# EAGLE design radio1 (EAGLE 7.1.0)
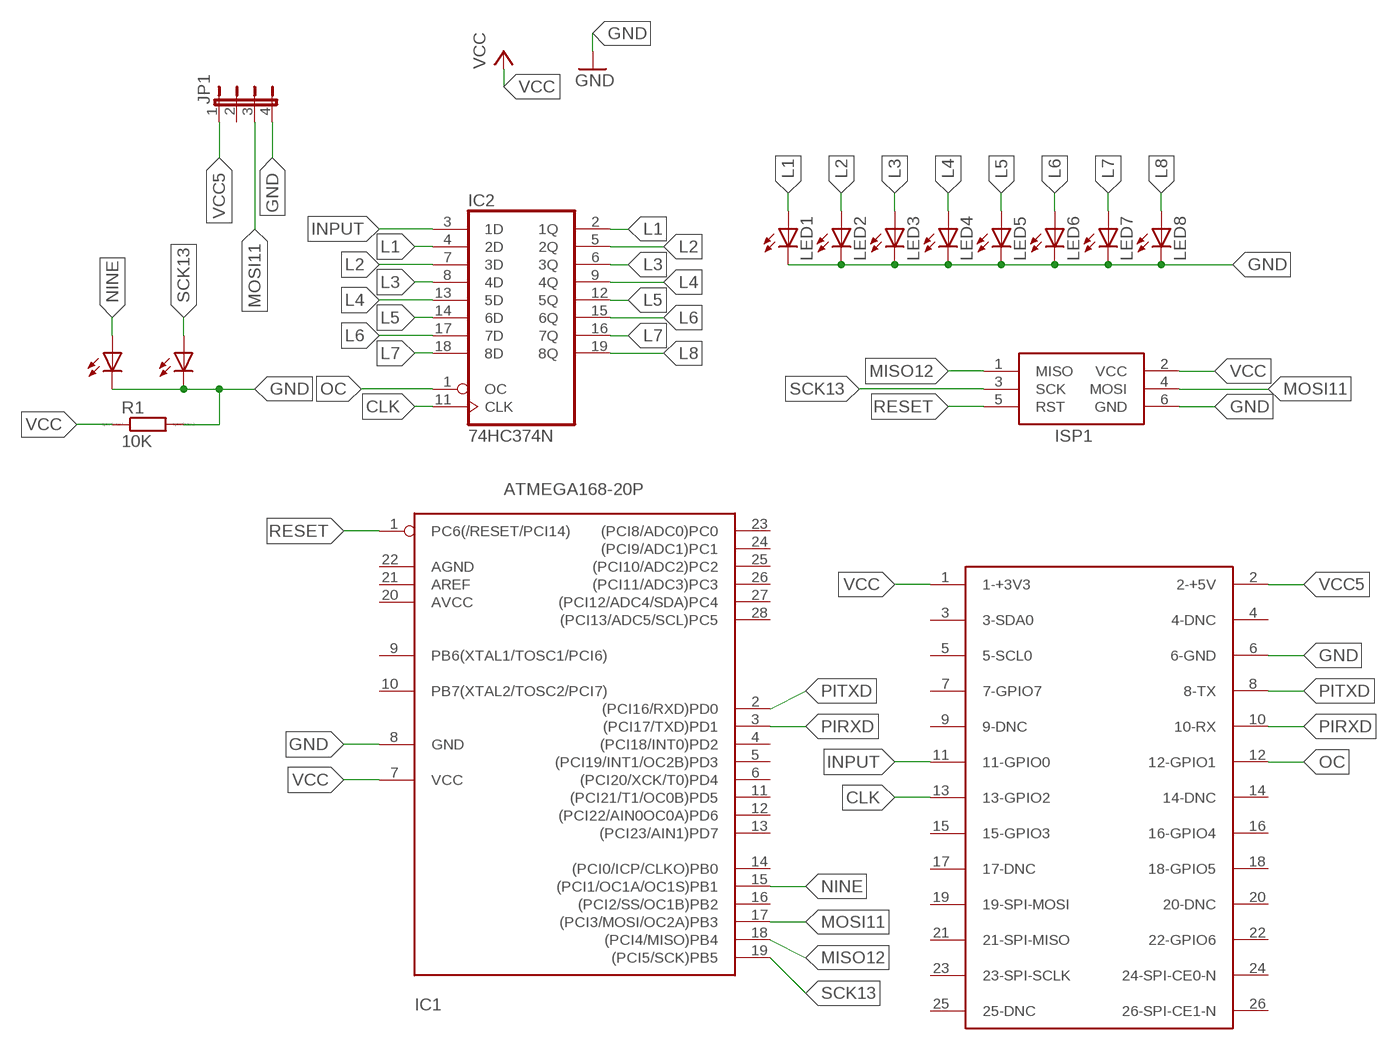
[diagram p0: schematic, sheet 1]

## Parts
IC1  ATMEGA168-20P  [DIL28-3]
IC2  74HC374N  [DIL20]
ISP1  AVRISP-6  [AVRISP]
JP1  JP4E  [JP4]
LED1  LED3MM  [LED3MM]
LED2  LED3MM  [LED3MM]
LED3  LED3MM  [LED3MM]
LED4  LED3MM  [LED3MM]
LED5  LED3MM  [LED3MM]
LED6  LED3MM  [LED3MM]
LED7  LED3MM  [LED3MM]
LED8  LED3MM  [LED3MM]
LED9  LED3MM  [LED3MM]
LED10  LED3MM  [LED3MM]
R1  10K  R-EU_0204_7  [0204/7]
U$1  RASPBERRY-PI  [RASPBERRY-PI]

## Nets
CLK: IC2.11(CLK) U$1.13(13-GPIO2)
GND: IC1.8(GND) ISP1.6(GND) JP1.4 LED1.K(C) LED2.K(C) LED3.K(C) LED4.K(C) LED5.K(C) LED6.K(C) LED7.K(C) LED8.K(C) LED9.K(C) LED10.K(C) R1.2 U$1.6(6-GND)
INPUT: IC2.3(1D) U$1.11(11-GPIO0)
L1: IC2.2(1Q) IC2.4(2D) LED1.A
L2: IC2.5(2Q) IC2.7(3D) LED2.A
L3: IC2.6(3Q) IC2.8(4D) LED3.A
L4: IC2.9(4Q) IC2.13(5D) LED4.A
L5: IC2.12(5Q) IC2.14(6D) LED5.A
L6: IC2.15(6Q) IC2.17(7D) LED6.A
L7: IC2.16(7Q) IC2.18(8D) LED7.A
L8: IC2.19(8Q) LED8.A
MISO12: IC1.18((PCI4/MISO)PB4) ISP1.1(MISO)
MOSI11: IC1.17((PCI3/MOSI/OC2A)PB3) ISP1.4(MOSI) JP1.3
NINE: IC1.15((PCI1/OC1A/OC1S)PB1) LED9.A
OC: IC2.1(OC) U$1.12(12-GPIO1)
PIRXD: IC1.3((PCI17/TXD)PD1) U$1.10(10-RX)
PITXD: IC1.2((PCI16/RXD)PD0) U$1.8(8-TX)
RESET: IC1.1(PC6(/RESET/PCI14)) ISP1.5(RST)
SCK13: IC1.19((PCI5/SCK)PB5) ISP1.3(SCK) LED10.A
VCC: IC1.7(VCC) ISP1.2(VCC) R1.1 U$1.1(1-+3V3)
VCC5: JP1.1 U$1.2(2-+5V)
Unconnected: IC1.4((PCI18/INT0)PD2) IC1.5((PCI19/INT1/OC2B)PD3) IC1.6((PCI20/XCK/T0)PD4) IC1.9(PB6(XTAL1/TOSC1/PCI6)) IC1.10(PB7(XTAL2/TOSC2/PCI7)) IC1.11((PCI21/T1/OC0B)PD5) IC1.12((PCI22/AIN0OC0A)PD6) IC1.13((PCI23/AIN1)PD7) IC1.14((PCI0/ICP/CLKO)PB0) IC1.16((PCI2/SS/OC1B)PB2) IC1.20(AVCC) IC1.21(AREF) IC1.22(AGND) IC1.23((PCI8/ADC0)PC0) IC1.24((PCI9/ADC1)PC1) IC1.25((PCI10/ADC2)PC2) IC1.26((PCI11/ADC3)PC3) IC1.27((PCI12/ADC4/SDA)PC4) IC1.28((PCI13/ADC5/SCL)PC5) JP1.2 U$1.3(3-SDA0) U$1.4(4-DNC) U$1.5(5-SCL0) U$1.7(7-GPIO7) U$1.9(9-DNC) U$1.14(14-DNC) U$1.15(15-GPIO3) U$1.16(16-GPIO4) U$1.17(17-DNC) U$1.18(18-GPIO5) U$1.19(19-SPI-MOSI) U$1.20(20-DNC) U$1.21(21-SPI-MISO) U$1.22(22-GPIO6) U$1.23(23-SPI-SCLK) U$1.24(24-SPI-CE0-N) U$1.25(25-DNC) U$1.26(26-SPI-CE1-N)

## Power pins joined to a net without a drawn wire
GND: IC2.10(GND)
VCC: IC2.20(VCC)

## Library data of the parts
IC1 = adafruit:ATMEGA168*P: MICROCONTROLLER 16 kBytes FLASH 1 kBytes SRAM 512 Bytes EEPROM USART 8-channel 10 bit ADC
IC2 = 74xx-eu:74*374: Octal D type transparent LATCH, edge triggered
ISP1 = adafruit:AVRISP: AVR ISP HEADER Standard 6 pin header for AVR programming
JP1 = jumper:JP4E: JUMPER
LED1-LED10 = adafruit:LED: LED OSRAM: - CHIPLED LG R971, LG N971, LY N971, LG Q971, LY Q971, LO R971, LY R971 LH N974, LH R974 LS Q976, LO Q976, LY Q976 LO Q996 - Hyper CHIPLED LW Q18S LB Q993, LB Q99A, LB R99A - SideLED LS A670, LO A670, LY A670, LG A670, LP A670 LB A673, LV A673, LT A673, LW A673 LH A674 LY A675 LS A676, LA A676, LO A676, LY A676, LW A676 LS A679, LY A679, LG A679 - Hyper Micro SIDELED® LS Y876, LA Y876, LO Y876, LY Y876 LT Y87S - SmartLED LW L88C, LW L88S LB L89C, LB L89S, LG L890 LS L89K, LO L89K, LY L89K LS L896, LA L896, LO L896, LY L896 - TOPLED LS T670, LO T670, LY T670, LG T670, LP T670 LSG T670, LSP T670, LSY T670, LOP T670, LYG T670 LG T671, LOG T671, LSG T671 LB T673, LV T673, LT T673, LW T673 LH T674 LS T676, LA T676, LO T676, LY T676, LB T676, LH T676, LSB T676, LW T676 LB T67C, LV T67C, LT T67C, LS T67K, LO T67K, LY T67K, LW E67C LS E67B, LA E67B, LO E67B, LY E67B, LB E67C, LV E67C, LT E67C LW T67C LS T679, LY T679, LG T679 LS T770, LO T770, LY T770, LG T770, LP T770 LB T773, LV T773, LT T773, LW T773 LH T774 LS E675, LA E675, LY E675, LS T675 LS T776, LA T776, LO T776, LY T776, LB T776 LHGB T686 LT T68C, LB T68C - Hyper Mini TOPLED® LB M676 - Mini TOPLED Santana® LG M470 LS M47K, LO M47K, LY M47K Source: http://www.osram.convergy.de/
R1 = resistor:R-EU_: RESISTOR, European symbol; SPICEPREFIX: R
U$1 = RaspberryPi:RASPBERRY-PI: Raspberry Pi Board <http://www.raspberrypi.org/> Jacques Lagnel V1.0 (beta) 2012 Board dimension: Forum 3D model <http://www.raspberrypi.org/forum/general-discussion/mechanical-profile-3d-models?value=3d%20model&type=1&include=1&search=1&ret=all> The GPIO Connector (P1): http://elinux.org/RPi_Low-level_peripherals

## Board
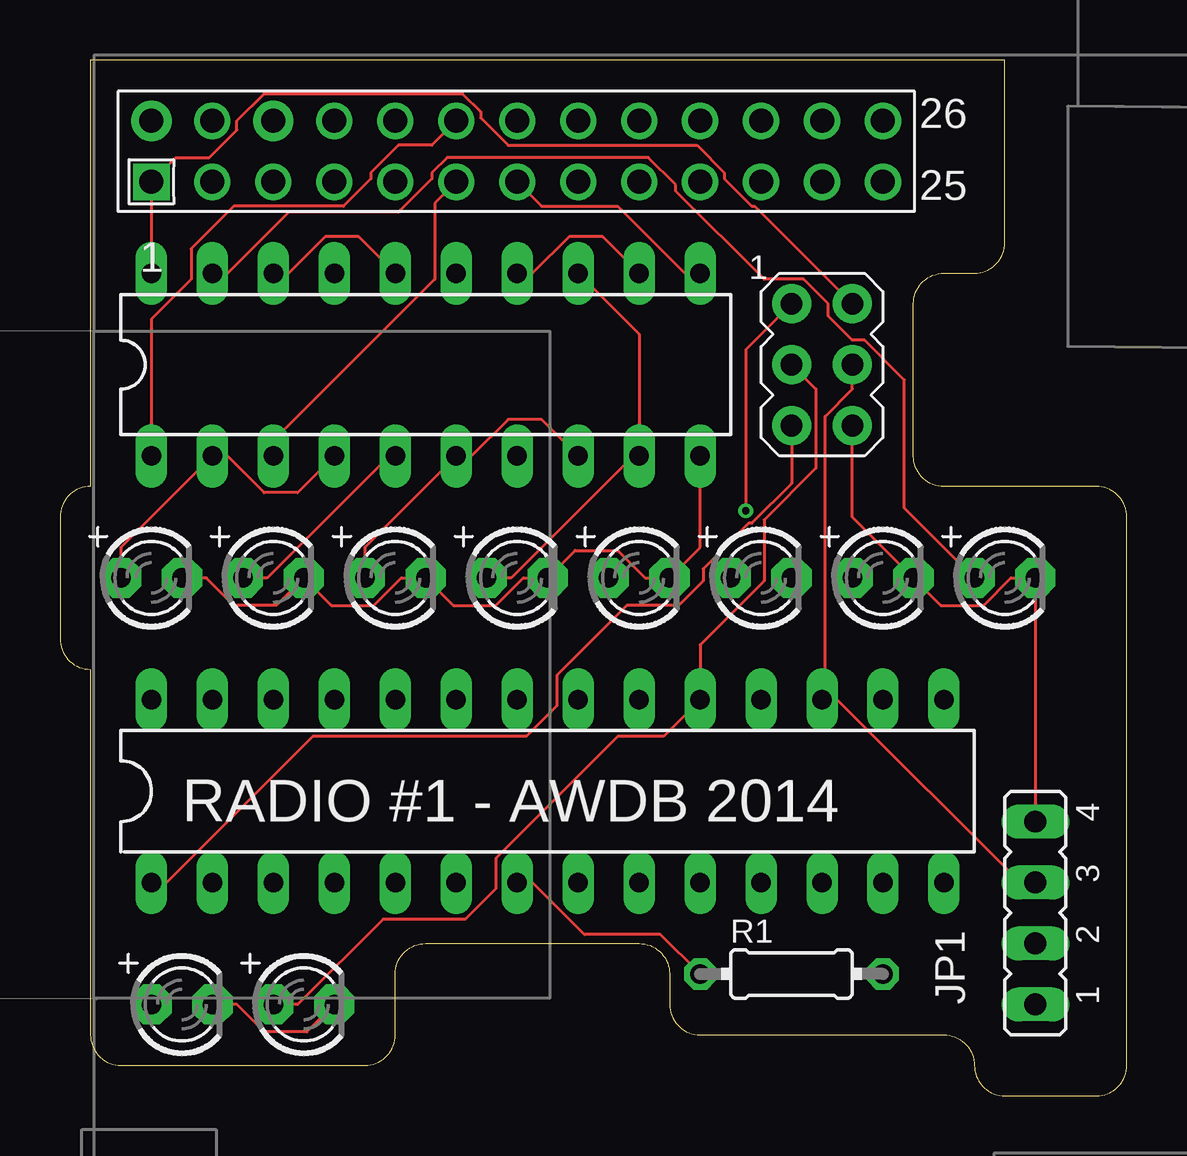
[diagram p1: board, top side]
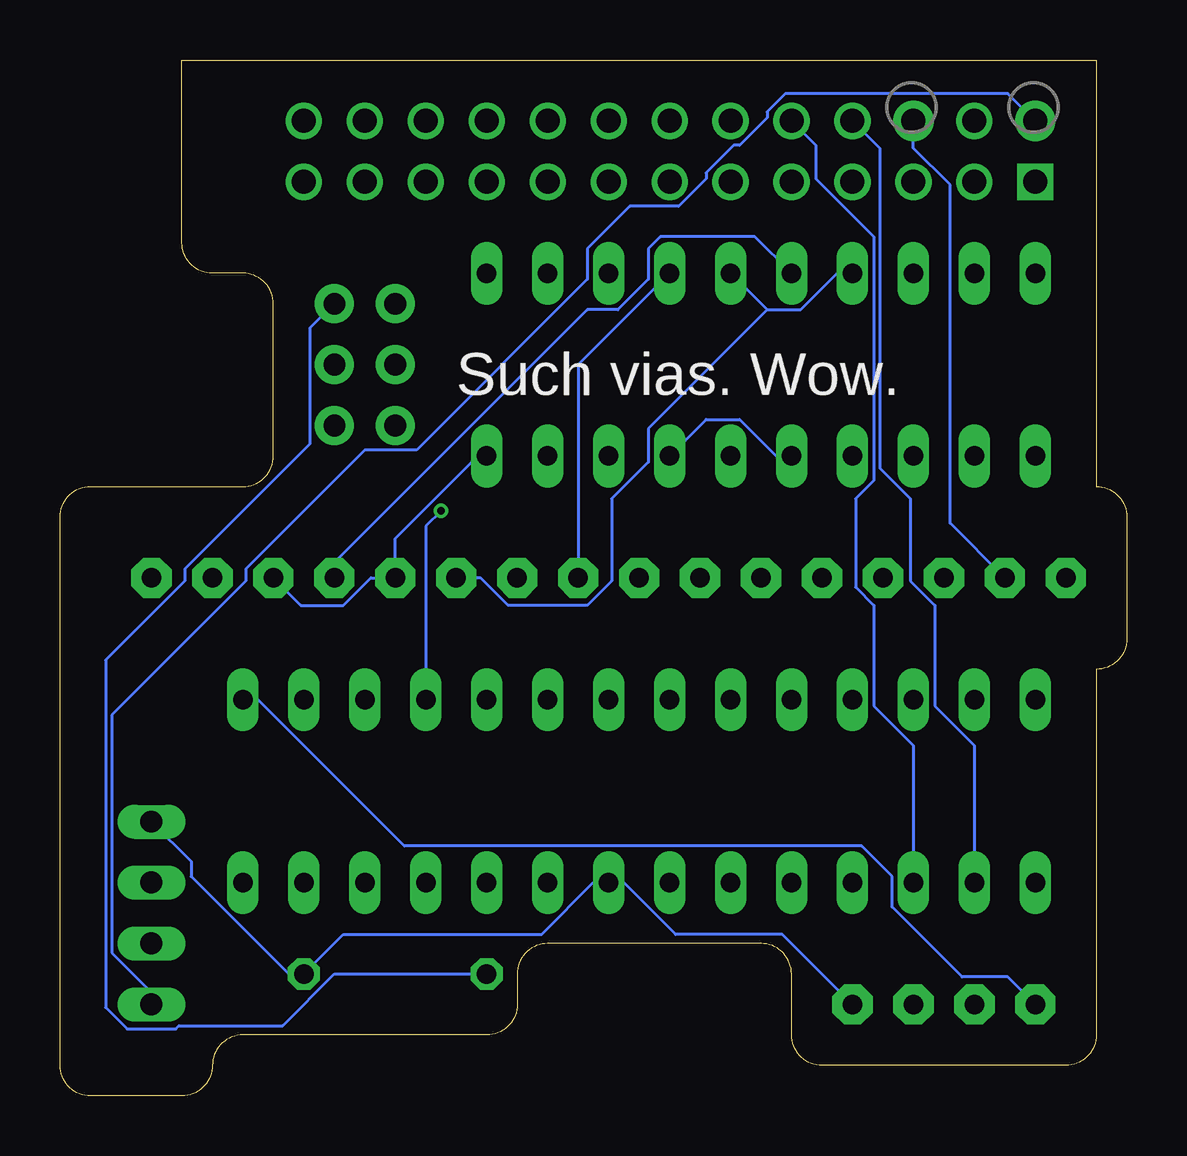
[diagram p2: board, bottom side, seen from below]

Size 44.45 x 43.18 mm. Coordinates in mm from the lower left corner, seen from the top.
Outline: 1.27,43.18 1.27,25.4 arc90 0,24.13 0,19.05 arc90 1.27,17.78 1.27,2.54 arc90 2.54,1.27 12.7,1.27 arc90 13.97,2.54 13.97,5.08 arc-90 15.24,6.35 24.13,6.35 arc-90 25.4,5.08 25.4,3.81 arc90 26.67,2.54 36.83,2.54 arc-90 38.1,1.27 arc90 39.37,0 43.18,0 arc90 44.45,1.27 44.45,24.13 arc90 43.18,25.4 36.83,25.4 arc-90 35.56,26.67 35.56,33.02 arc-90 36.83,34.29 38.1,34.29 arc90 39.37,35.56 39.37,43.18 1.27,43.18
Copper layers (1*16): Top 0.035mm / dielectric 1.5mm / Bottom 0.035mm
Design rules "dirt_cheap_dirty_boards.v1": minimum track width 5mil, minimum drill 12mil, track to track 5mil, track to pad 5mil, pad to pad 5mil, via to via 5mil, smd to smd 0mil, copper to edge 10mil, drill to drill 10mil, minimum pad ring 10mil, minimum via ring 6mil, stop-mask expansion 2mil, vias tented up to drill 25mil, thermal gap 10mil

### Footprints (pad centres in the part's own frame; a part is rotated, then mirrored left to right if it is on the bottom)
DIL28-3 = drill 0.813 long: 1 -16.51,-3.81; 2 -13.97,-3.81; 3 -11.43,-3.81; 4 -8.89,-3.81; 5 -6.35,-3.81; 6 -3.81,-3.81; 7 -1.27,-3.81; 8 1.27,-3.81; 9 3.81,-3.81; 10 6.35,-3.81; 11 8.89,-3.81; 12 11.43,-3.81; 13 13.97,-3.81; 14 16.51,-3.81; 15 16.51,3.81; 16 13.97,3.81; 17 11.43,3.81; 18 8.89,3.81; 19 6.35,3.81; 20 3.81,3.81; 21 1.27,3.81; 22 -1.27,3.81; 23 -3.81,3.81; 24 -6.35,3.81; 25 -8.89,3.81; 26 -11.43,3.81; 27 -13.97,3.81; 28 -16.51,3.81
DIL20 = drill 0.813 long: 1 -11.43,-3.81; 2 -8.89,-3.81; 3 -6.35,-3.81; 4 -3.81,-3.81; 5 -1.27,-3.81; 6 1.27,-3.81; 7 3.81,-3.81; 8 6.35,-3.81; 9 8.89,-3.81; 10 11.43,-3.81; 11 11.43,3.81; 12 8.89,3.81; 13 6.35,3.81; 14 3.81,3.81; 15 1.27,3.81; 16 -1.27,3.81; 17 -3.81,3.81; 18 -6.35,3.81; 19 -8.89,3.81; 20 -11.43,3.81
AVRISP = drill 0.9 pad 1.626: 1 -1.27,2.54; 2 1.27,2.54; 3 -1.27,0; 4 1.27,0; 5 -1.27,-2.54; 6 1.27,-2.54
JP4 = drill 0.914 long: 1 -3.81,0; 2 -1.27,0; 3 1.27,0; 4 3.81,0
LED3MM = drill 0.813 pad 1.676 octagon: A -1.27,0; K 1.27,0
0204/7 = drill 0.813 octagon: 1 -3.81,0; 2 3.81,0
RASPBERRY-PI = drill 1 square: 1 0,0 | drill 1 pad 1.676: 2 0,2.54; 6 5.08,2.54 | drill 1: 3 2.54,0; 4 2.54,2.54; 5 5.08,0; 7 7.62,0; 8 7.62,2.54; 9 10.16,0; 10 10.16,2.54; 11 12.7,0; 12 12.7,2.54; 13 15.24,0; 14 15.24,2.54; 15 17.78,0; 16 17.78,2.54; 17 20.32,0; 18 20.32,2.54; 19 22.86,0; 20 22.86,2.54; 21 25.4,0; 22 25.4,2.54; 23 27.94,0; 24 27.94,2.54; 25 30.48,0; 26 30.48,2.54

### Placement (x,y rotation side)
IC1  20.32,12.7 0 top
IC2  15.24,30.48 0 top
ISP1  31.75,30.48 0 top
JP1  40.64,7.62 90 top
LED1  3.81,21.59 0 top
LED2  8.89,21.59 0 top
LED3  13.97,21.59 0 top
LED4  19.05,21.59 0 top
LED5  24.13,21.59 0 top
LED6  29.21,21.59 0 top
LED7  34.29,21.59 0 top
LED8  39.37,21.59 0 top
LED9  5.08,3.81 0 top
LED10  10.16,3.81 0 top
R1  30.48,5.08 0 top
U$1  3.81,38.1 0 top

### Tracks (layer width: path | path; a pad name or v marks a point on that pad's centre or on a via)
CLK
  Top 0.127: IC2.11 26.04,34.29 23.24,37.08 20.07,37.08 U$1.13
GND
  Top 0.127: IC2.10 26.67,22.86 LED5.K 24.38,21.59 23.24,22.73 21.46,22.73 LED4.K 19.3,21.59 18.16,20.45 16.38,20.45 LED3.K 14.22,21.59 13.08,20.45 11.3,20.45 LED2.K 9.02,20.45 7.24,20.45 6.1,21.59 LED1.K | LED9.K 7.37,3.81 8.51,2.67 10.29,2.67 LED10.K | ISP1.6 33.02,24.13 LED7.K 36.7,20.45 38.48,20.45 39.62,21.59 LED8.K JP1.4
  Bottom 0.127: U$1.6 8.89,39.5 7.37,37.97 7.37,23.88 LED1.K | LED10.K 14.35,6.73 18.8,6.73 20.95,8.89 IC1.8 22.22,8.89 24.38,6.73 32.64,6.73 R1.2 34.93,5.08 38.99,9.14 38.99,9.78 JP1.4 | LED7.K 34.42,20.45 32.64,20.45 31.5,21.59 LED6.K 30.48,23.24 27.05,26.67 IC2.10
INPUT
  Top 0.127: IC2.3 8.89,27.3 15.62,34.04 15.62,37.21 U$1.11
L1
  Top 0.127: IC2.4 9.91,25.15 8.51,25.15 6.98,26.67 IC2.2 2.54,22.86 LED1.A
L2
  Top 0.127: LED2.A 8.64,21.59 13.72,26.67 IC2.5
  Bottom 0.127: IC2.5 14.61,26.67 16.13,28.19 17.53,28.19 IC2.7
L3
  Top 0.127: IC2.8 20.07,28.19 18.67,28.19 17.14,26.67 IC2.6 12.7,22.86 LED3.A
L4
  Top 0.127: 24.13,26.92 24.13,31.75 IC2.13 | LED4.A 18.8,21.59 24.13,26.92 | 24.13,26.92 IC2.9
L5
  Top 0.127: IC2.14 19.68,34.29 21.21,35.81 22.61,35.81 IC2.12
  Bottom 0.127: LED5.A 22.86,30.48 IC2.14
L6
  Bottom 0.127: IC2.17 12.06,34.29 13.59,32.77 14.99,32.77 | IC2.15 14.99,32.77 | LED6.A 26.92,21.59 25.78,20.45 22.48,20.45 21.46,21.46 21.46,24.89 19.94,26.42 19.94,27.81 14.99,32.77
L7
  Top 0.127: IC2.18 9.53,34.29 11.05,35.81 12.45,35.81 IC2.16
  Bottom 0.127: LED7.A 33.02,22.22 22.48,32.77 21.21,32.77 19.94,34.04 19.94,35.31 19.43,35.81 15.49,35.81 IC2.16
L8
  Top 0.127: IC2.19 6.98,34.29 9.53,36.83 14.1,36.83 15.49,38.23 15.49,38.48 16.13,39.12 24.51,39.12 25.65,37.97 25.65,37.72 29.34,34.04 30.99,34.04 32,33.02 32,32.51 33.02,31.5 33.53,31.5 35.18,29.84 35.18,24.51 LED8.A
MISO12  (via drill 0.3)
  Top 0.127: v28.57,24.38 28.57,31.11 ISP1.1
  Bottom 0.127: IC1.18 29.21,23.75 v28.57,24.38
MOSI11
  Top 0.127: 31.88,16.51 32.38,16.51 40.01,8.89 JP1.3 | ISP1.4 33.02,29.46 31.88,28.32 31.88,16.51 | 31.88,16.51 IC1.17
NINE
  Bottom 0.127: IC1.15 36.2,16.51 30.1,10.41 11.05,10.41 9.78,9.14 9.78,7.87 6.86,4.95 4.95,4.95 LED9.A
OC
  Top 0.127: IC2.1 3.81,32.38 5.46,34.04 5.46,35.31 7.24,37.08 11.81,37.08 12.95,38.23 12.95,38.48 14.1,39.62 15.49,39.62 U$1.12
PIRXD
  Bottom 0.127: IC1.3 8.89,14.61 10.54,16.26 10.54,20.45 11.3,21.21 11.3,24.89 10.54,25.65 10.54,35.81 12.95,38.23 12.95,39.62 U$1.10
PITXD
  Bottom 0.127: IC1.2 6.35,14.61 8,16.26 8,20.45 9.02,21.46 9.02,24.89 10.29,26.16 10.29,39.5 U$1.8
RESET
  Top 0.127: IC1.1 4.45,8.89 10.54,14.99 19.43,14.99 20.7,16.26 20.7,17.53 23.62,20.45 25.78,20.45 26.8,21.46 26.8,21.97 28.7,23.88 28.83,23.88 30.48,25.53 ISP1.5
SCK13
  Top 0.127: ISP1.3 31.5,29.46 31.5,26.16 29.34,24 29.34,21.46 26.67,18.8 IC1.19 25.15,14.99 23.24,14.99 18.16,9.91 18.16,8.64 16.89,7.37 13.46,7.37 9.91,3.81 LED10.A
VCC
  Top 0.127: IC1.7 19.68,8.89 21.84,6.73 25.02,6.73 R1.1 | IC2.20 U$1.1 4.83,39.12 6.22,39.12 7.37,40.26 7.37,40.64 8.51,41.78 16.76,41.78 17.53,41.02 17.53,40.77 18.67,39.62 26.54,39.62 27.69,38.48 27.69,38.23 28.83,37.08 28.96,37.08 ISP1.2
  Bottom 0.127: R1.1 33.02,5.08 35.18,2.92 39.5,2.92 39.62,2.79 41.66,2.79 42.55,3.68 42.55,18.16 39.24,21.46 39.24,21.97 34.04,27.18 34.04,32 ISP1.2
VCC5
  Bottom 0.127: JP1.1 40.64,4.32 42.29,5.97 42.29,15.88 36.7,21.46 36.7,21.97 31.75,26.92 29.59,26.92 22.48,34.04 22.48,35.31 20.7,37.08 18.67,37.08 17.53,38.23 17.53,38.48 16.38,39.62 16.13,39.62 14.99,40.77 14.99,41.02 14.22,41.78 4.95,41.78 U$1.2

### Text on the board
tNames: RADIO #1 - AWDB 2014
bNames: Such vias. Wow.